# Altium schematic sheet Sheet1.SchDoc
size A4
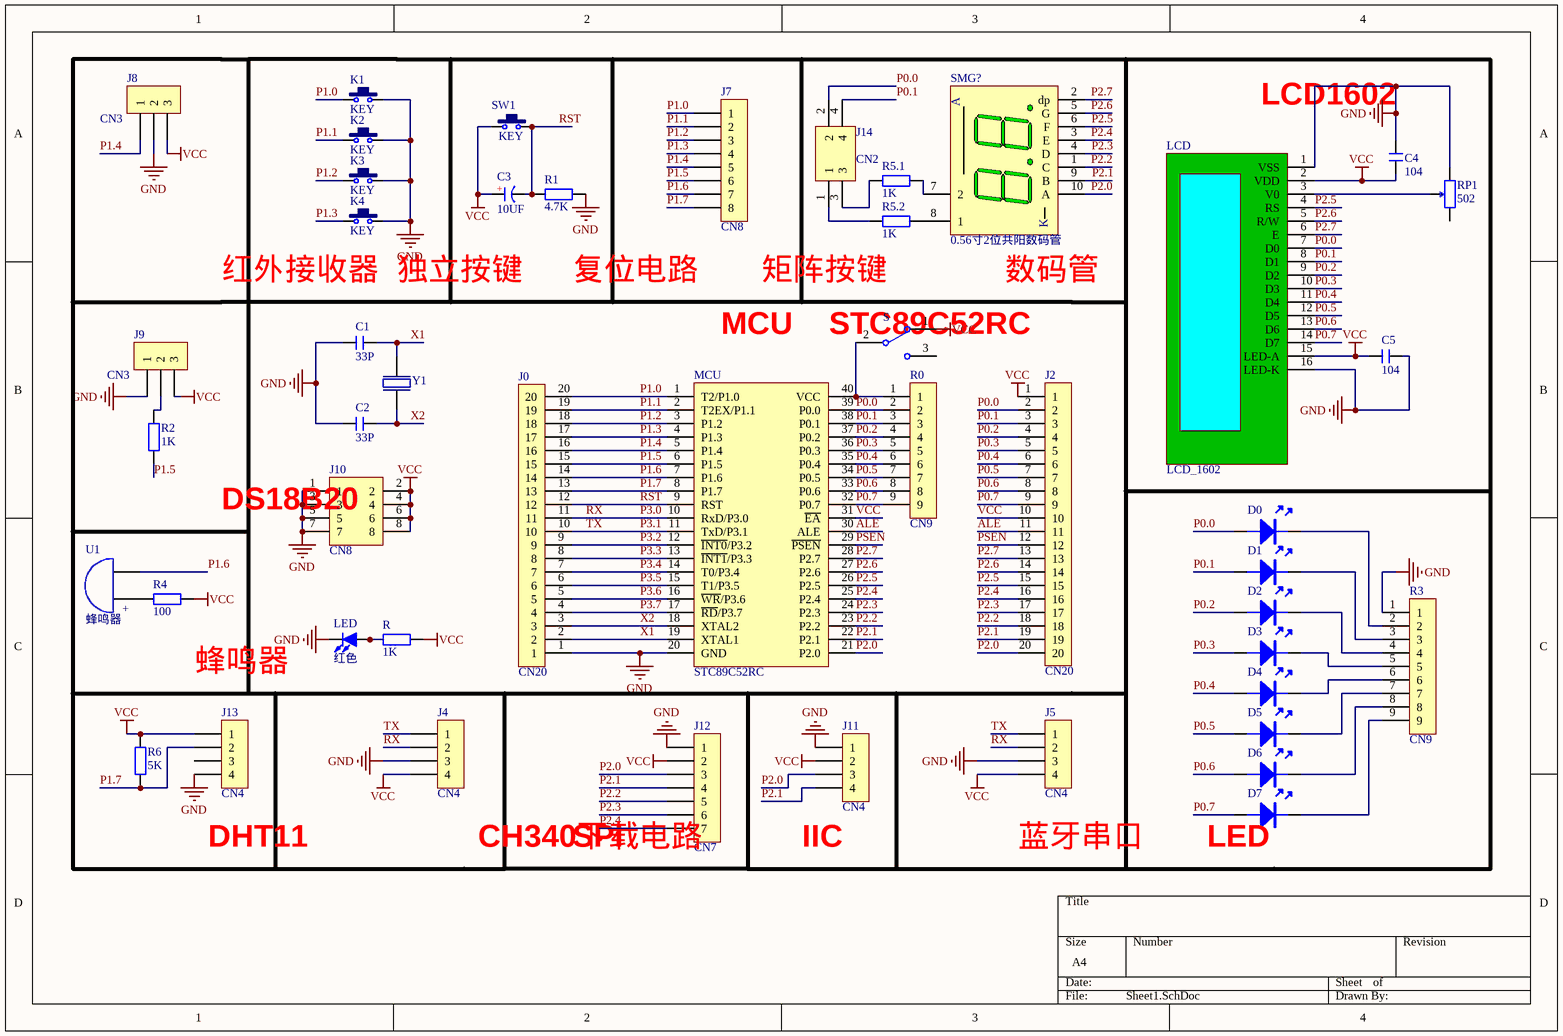
[diagram p0: Sheet1.SchDoc]

## Parts
C1  33P  [C 0805]
C2  33P  [C 0805]
C3  10UF  [CAP 3.5*8*11.5 - BK]
C4  104  [C 0805]
C5  104  [C 0805]
D0  (no value)  [LED-0805R]
D1  (no value)  [LED-0805R]
D2  (no value)  [LED-0805R]
D3  (no value)  [LED-0805R]
D4  (no value)  [LED-0805R]
D5  (no value)  [LED-0805R]
D6  (no value)  [LED-0805R]
D7  (no value)  [LED-0805R]
J0  CN20  [HDR-1X20]
J2  CN20  [HDR-1X20]
J4  CN4  [Fe-HDR1X4/2.54-S]
J5  CN4  [Fe-HDR1X4/2.54-S]
J7  CN8  [Fe-HDR1X8/2.54-S]
J8  CN3  [Fe-HDR1X3/2.54-S]
J9  CN3  [Fe-HDR1X3/2.54-S]
J10  CN8  [Pin HDR2X4/2.54mm-S]
J11  CN4  [Pin HDR1X4/2.54mm-S]
J12  CN7  [Pin HDR1X7/2.54mm-S]
J13  CN4  [Fe-HDR1X4/2.54-S]
J14  CN2  [Pin HDR2X2/2.54mm-S]
K1  KEY  [TSW SMD-3*6*5]
K2  KEY  [TSW SMD-3*6*5]
K3  KEY  [TSW SMD-3*6*5]
K4  KEY  [TSW SMD-3*6*5]
LCD  LCD_1602  [LCD-1602]
LED  红色  [LED-5mm]
MCU  STC89C52RC  [DIP40-600]
R  1K  [R 0805]
R0  CN9  [HDR-1X9_Y]
R1  4.7K  [R 0805]
R2  1K  [R 0805]
R3  CN9  [HDR-1X9_Y]
R4  100  [R 0805]
R5.1  1K  [R 0805]
R5.2  1K  [R 0805]
R6  5K  [R 0805]
RP1  502  [RM065]
S  (no value)  [SS-12D10]
SMG?  0.56寸2位共阳数码管  [SMG 0.56-2P]
SW1  KEY  [TSW SMD-3*6*5]
U1  蜂鸣器  [BEEP 7.6x12x9.5]
Y1  (no value)  [XTAL-49S DIP]

## Nets
GND: C1.1 C2.1 C4.1 C5.2 J0.1 J4.3 J5.3 J8.2 J9.1 J10.1 J10.3 J10.5 J10.7 J11.1 J12.1 J13.4 K1.2 K2.2 K3.2 K4.2 LCD.1(VSS) LCD.16(LED-K) LED.2(K) MCU.20(GND) R1.2 R3.1 RP1.2
VCC: C3.1(A) C4.2 C5.1 J2.1 J2.10 J4.4 J5.4 J8.3 J9.3 J10.2 J10.4 J10.6 J10.8 J11.2 J12.2 J13.1 LCD.2(VDD) LCD.15(LED-A) MCU.31(~{EA}) R.1 R4.2 R6.1 S.1 SW1.1
ALE: J2.11 MCU.30(ALE)
P0.0: D0.A J2.2 J14.2 LCD.7(D0) MCU.39(P0.0) R0.2
P0.1: D1.A J2.3 J14.4 LCD.8(D1) MCU.38(P0.1) R0.3
P0.2: D2.A J2.4 LCD.9(D2) MCU.37(P0.2) R0.4
P0.3: D3.A J2.5 LCD.10(D3) MCU.36(P0.3) R0.5
P0.4: D4.A J2.6 LCD.11(D4) MCU.35(P0.4) R0.6
P0.5: D5.A J2.7 LCD.12(D5) MCU.34(P0.5) R0.7
P0.6: D6.A J2.8 LCD.13(D6) MCU.33(P0.6) R0.8
P0.7: D7.A J2.9 LCD.14(D7) MCU.32(P0.7) R0.9
P1.0: J0.20 J7.1 K1.1 MCU.1(T2/P1.0)
P1.1: J0.19 J7.2 K2.1 MCU.2(T2EX/P1.1)
P1.2: J0.18 J7.3 K3.1 MCU.3(P1.2)
P1.3: J0.17 J7.4 K4.1 MCU.4(P1.3)
P1.4: J0.16 J7.5 J8.1 MCU.5(P1.4)
P1.5: J0.15 J7.6 MCU.6(P1.5) R2.1
P1.6: J0.14 J7.7 MCU.7(P1.6) U1.2
P1.7: J0.13 J7.8 J13.2 MCU.8(P1.7) R6.2
P2.0: J2.20 J11.3 J12.3 MCU.21(P2.0) SMG?.10(A)
P2.1: J2.19 J11.4 J12.4 MCU.22(P2.1) SMG?.9(B)
P2.2: J2.18 J12.5 MCU.23(P2.2) SMG?.1(C)
P2.3: J2.17 J12.6 MCU.24(P2.3) SMG?.4(D)
P2.4: J2.16 J12.7 MCU.25(P2.4) SMG?.3(E)
P2.5: J2.15 LCD.4(RS) MCU.26(P2.5) SMG?.6(F)
P2.6: J2.14 LCD.5(R/W) MCU.27(P2.6) SMG?.5(G)
P2.7: J2.13 LCD.6(E) MCU.28(P2.7) SMG?.2(dp)
P3.0: J0.11 J4.2 J5.2 MCU.10(RxD/P3.0)  [also labelled RX]
P3.1: J0.10 J4.1 J5.1 MCU.11(TxD/P3.1)  [also labelled TX]
P3.2: J0.9 MCU.12(~{INT0}/P3.2)
P3.3: J0.8 MCU.13(~{INT1}/P3.3)
P3.4: J0.7 MCU.14(T0/P3.4)
P3.5: J0.6 MCU.15(T1/P3.5)
P3.6: J0.5 MCU.16(~{WR}/P3.6)
P3.7: J0.4 MCU.17(~{RD}/P3.7)
PSEN: J2.12 MCU.29(~{PSEN})
RST: C3.2(K) J0.12 MCU.9(RST) R1.1 SW1.2
X1: C1.2 J0.2 MCU.19(XTAL1) Y1.1
X2: C2.2 J0.3 MCU.18(XTAL2) Y1.2
NetD0_K: D0.K R3.2
NetD1_K: D1.K R3.3
NetD2_K: D2.K R3.4
NetD3_K: D3.K R3.5
NetD4_K: D4.K R3.6
NetD5_K: D5.K R3.7
NetD6_K: D6.K R3.8
NetD7_K: D7.K R3.9
NetJ9_2: J9.2 R2.2
NetJ14_1: J14.1 R5.2.2
NetJ14_3: J14.3 R5.1.2
NetLCD_3: LCD.3(V0) RP1.ADJ
NetLED_1: LED.1(A) R.2
NetMCU_40: MCU.40(VCC) R0.1 S.2
NetR4_1: R4.1 U1.1
NetR5.1_1: R5.1.1 SMG?.7(2)
NetR5.2_1: R5.2.1 SMG?.8(1)

Not connected (* = marked no-connect by the designer): J13 3; RP1 1; S 3

## Notes on the sheet
- LCD1602
- 红外接收器
- (near K4) 独立按键
- 复位电路
- (near J7) 矩阵按键
- (near SMG?) 数码管
- MCU    STC89C52RC
- (near R2) DS18B20
- 蜂鸣器
- DHT11
- (near J4) CH340下载电路
- SPI
- IIC
- (near J5) 蓝牙串口
- LED
- (in symbol 0.56寸2位共阳数码管) K
- (in symbol 电解电容) +
- (in symbol 蜂鸣器) +

## Library data of the parts
C1 C2 C4 C5 = 瓷片电容: C-CC; BOM名称: 直插瓷片电容; 版权归属: 源创客; 学习资源: www.ooocke.com
C3 = 电解电容: CAP-E; BOM名称: 直插电解电容; 版权归属: 源创客; 学习资源: www.ooocke.com
D0-D7 = LED
J0 J2 = CN20: CN20*1
J4 J5 J13 = Female HDR1X4
J7 = Female HDR1X8
J8 J9 = Female HDR1X3
J10 = Pin HDR2X4
J11 = Pin HDR1X4
J12 = Pin HDR1X7
J14 = Pin HDR2X2
K1-K4 SW1 = 2脚按键
LCD = LCD_1602: LCD_1602显示模块; 版权归属: 源创客; BOM名称: LCD 1602; 学习资源: www.ooocke.com
LED = LED灯: 插件LED; 版权归属: 源创客; BOM名称: 插件LED; 学习资源: www.ooocke.com
MCU = STC89C52RC: STC单片机; 版权归属: 源创客; BOM名称: STC单片机; 学习资源: www.ooocke.com
R R1 R2 R4 R5.1 R5.2 R6 = 电阻: R; BOM名称: 贴片电阻; 版权归属: 源创客; 学习资源: www.ooocke.com
R0 R3 = CN9: CN9*1
RP1 = 电位器: RP-ID; BOM名称: 插件电位器; 版权归属: 源创客; 学习资源: www.ooocke.com
S = SS-12D10
SMG? = 0.56寸2位共阳数码管: 5621B; 版权归属: 源创客; BOM名称: 0.56寸2位共阳; 学习资源: www.ooocke.com
U1 = 蜂鸣器: BEEP
Y1 = 晶振: CRY